# EAGLE design micromouse (EAGLE 9.5.1)
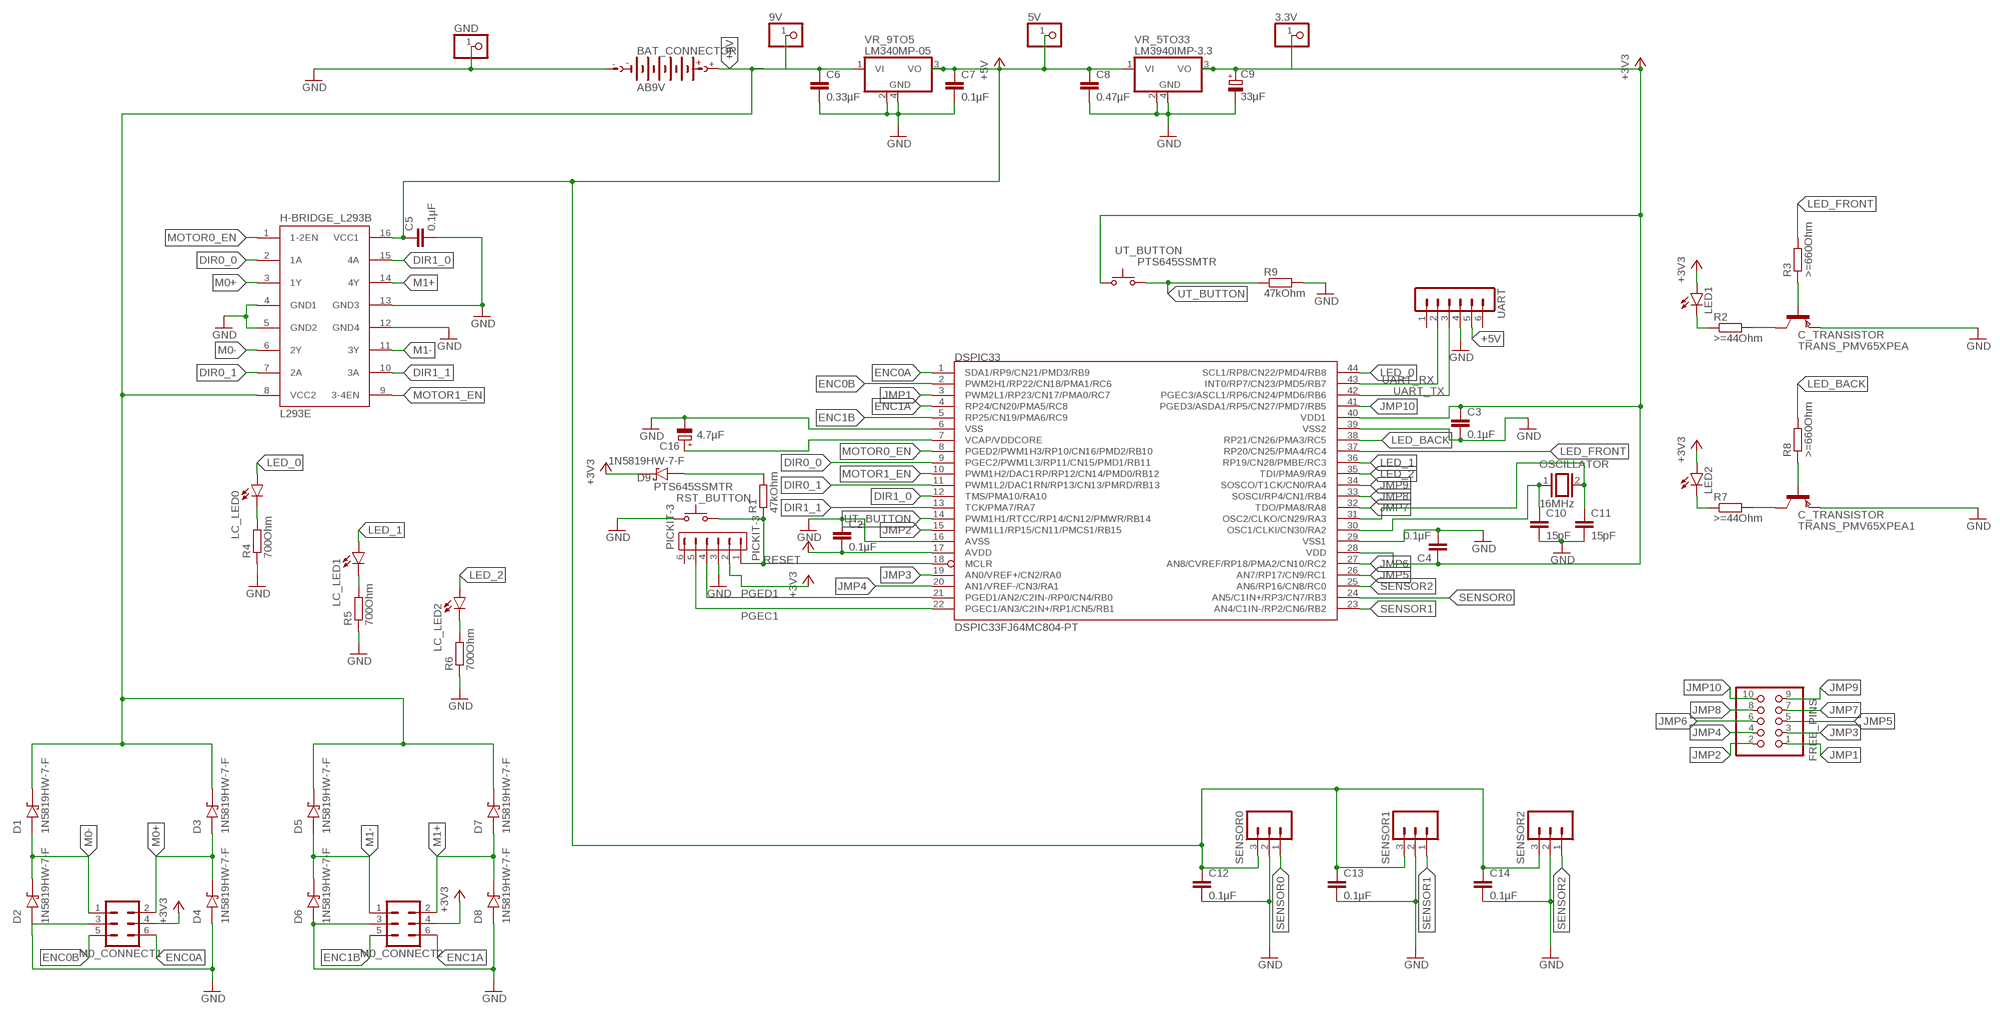
[diagram p0: schematic, sheet 1]

## Parts
3.3V  PINHD-1X1  [1X01]
5V  PINHD-1X1  [1X01]
9V  PINHD-1X1  [1X01]
BAT_CONNECTOR  AB9V  [AB9V]
C2  0.1µF  C-EUC0805  [C0805]
C3  0.1µF  C-EUC0805  [C0805]
C4  0.1µF  C-EUC0805  [C0805]
C5  0.1µF  C-EUC0805  [C0805]
C6  0.33µF  C-EUC0805  [C0805]
C7  0.1µF  C-EUC0805  [C0805]
C8  0.47µF  C-EUC0805  [C0805]
C9  33µF  CPOL-EUD/7343-31W  [D/7343-31W]
C10  15pF  C-EUC0805  [C0805]
C11  15pF  C-EUC0805  [C0805]
C12  0.1µF  C-EUC0805  [C0805]
C13  0.1µF  C-EUC0805  [C0805]
C14  0.1µF  C-EUC0805  [C0805]
C16  4.7µF  CPOL-EUCT3528  [CT3528]
D1  1N5819HW-7-F  [SOD3715X145N]
D2  1N5819HW-7-F  [SOD3715X145N]
D3  1N5819HW-7-F  [SOD3715X145N]
D4  1N5819HW-7-F  [SOD3715X145N]
D5  1N5819HW-7-F  [SOD3715X145N]
D6  1N5819HW-7-F  [SOD3715X145N]
D7  1N5819HW-7-F  [SOD3715X145N]
D8  1N5819HW-7-F  [SOD3715X145N]
D9  1N5819HW-7-F  [SOD3715X145N]
DSPIC33  DSPIC33FJ64MC804-PT  [TQFP44]
FREE_PINS  PINHD-2X5  [2X05]
GND  PINHD-1X1  [1X01]
H-BRIDGE_L293B  L293E  [DIL16]
LC_LED0  LED5MM  [LED5MM]
LC_LED1  LED5MM  [LED5MM]
LC_LED2  LED5MM  [LED5MM]
LED1  L-1503ID-LED-DLED  [L-1503ID-LED]
LED2  L-1503ID-LED-DLED  [L-1503ID-LED]
M0_CONNECT1  MA03-2  [MA03-2]
M0_CONNECT2  MA03-2  [MA03-2]
OSCILLATOR  16MHz  XTAL/S  [QS]
PICKIT-3  PICKIT-3  [1X06]
R1  47kOhm  R-EU_R0805  [R0805]
R2  >=44Ohm  R-EU_R0805  [R0805]
R3  >=660Ohm  R-EU_R0805  [R0805]
R4  700Ohm  R-EU_R0805  [R0805]
R5  700Ohm  R-EU_R0805  [R0805]
R6  700Ohm  R-EU_R0805  [R0805]
R7  >=44Ohm  R-EU_R0805  [R0805]
R8  >=660Ohm  R-EU_R0805  [R0805]
R9  47kOhm  R-EU_R0805  [R0805]
RST_BUTTON  PTS645SSMTR  [PTS645-SMD]
SENSOR0  M03  [03P]
SENSOR1  M03  [03P]
SENSOR2  M03  [03P]
TRANS_PMV65XPEA  C_TRANSISTOR  [SOT23]
TRANS_PMV65XPEA1  C_TRANSISTOR  [SOT23]
UART  MA06-1  [MA06-1]
UT_BUTTON  PTS645SSMTR  [PTS645-SMD]
VR_5TO33  LM3940IMP-3.3  [SOT223]
VR_9TO5  LM340MP-05  [SOT223]

## Nets
+3V3: 3.3V.1 C2.2 C3.1 C4.1 C9.+ D9.C(K) DSPIC33.17(AVDD) DSPIC33.28(VDD) DSPIC33.40(VDD1) LED1.A LED2.A M0_CONNECT1.4 M0_CONNECT2.4 PICKIT-3.2(VDD) UT_BUTTON.1(P) UT_BUTTON.2(P) VR_5TO33.3(VO)
+5V: 5V.1 C5.1 C7.1 C8.1 C12.1 C13.1 C14.1 H-BRIDGE_L293B.16(VCC1) SENSOR0.3 SENSOR1.3 SENSOR2.3 UART.5 VR_5TO33.1(VI) VR_9TO5.3(VO)
+9V: 9V.1 BAT_CONNECTOR.+ C6.1 D1.C(K) D3.C(K) D5.C(K) D7.C(K) H-BRIDGE_L293B.8(VCC2) VR_9TO5.1(VI)
DIR0_0: DSPIC33.9(PGEC2/PWM1L3/RP11/CN15/PMD1/RB11) H-BRIDGE_L293B.2(1A)
DIR0_1: DSPIC33.11(PWM1L2/DAC1RN/RP13/CN13/PMRD/RB13) H-BRIDGE_L293B.7(2A)
DIR1_0: DSPIC33.12(TMS/PMA10/RA10) H-BRIDGE_L293B.15(4A)
DIR1_1: DSPIC33.13(TCK/PMA7/RA7) H-BRIDGE_L293B.10(3A)
ENC0A: DSPIC33.1(SDA1/RP9/CN21/PMD3/RB9) M0_CONNECT1.6
ENC0B: DSPIC33.2(PWM2H1/RP22/CN18/PMA1/RC6) M0_CONNECT1.5
ENC1A: DSPIC33.4(RP24/CN20/PMA5/RC8) M0_CONNECT2.6
ENC1B: DSPIC33.5(RP25/CN19/PMA6/RC9) M0_CONNECT2.5
GND: BAT_CONNECTOR.- C2.1 C3.2 C4.2 C5.2 C6.2 C7.2 C8.2 C9.- C10.2 C11.2 C12.2 C13.2 C14.2 C16.- D2.A D4.A D6.A D8.A DSPIC33.6(VSS) DSPIC33.16(AVSS) DSPIC33.29(VSS1) DSPIC33.39(VSS2) GND.1 H-BRIDGE_L293B.4(GND1) H-BRIDGE_L293B.5(GND2) H-BRIDGE_L293B.12(GND4) H-BRIDGE_L293B.13(GND3) M0_CONNECT1.3 M0_CONNECT2.3 PICKIT-3.3(VSS) R4.1 R5.1 R6.1 R9.2 RST_BUTTON.1(P) RST_BUTTON.2(P) SENSOR0.2 SENSOR1.2 SENSOR2.2 TRANS_PMV65XPEA1.2(E) TRANS_PMV65XPEA.2(E) UART.4 VR_5TO33.2(GND1) VR_5TO33.4(GND) VR_9TO5.2(GND1) VR_9TO5.4(GND)
JMP1: DSPIC33.3(PWM2L1/RP23/CN17/PMA0/RC7) FREE_PINS.1
JMP2: DSPIC33.15(PWM1L1/RP15/CN11/PMCS1/RB15) FREE_PINS.2
JMP3: DSPIC33.19(AN0/VREF+/CN2/RA0) FREE_PINS.3
JMP4: DSPIC33.20(AN1/VREF-/CN3/RA1) FREE_PINS.4
JMP5: DSPIC33.26(AN7/RP17/CN9/RC1) FREE_PINS.5
JMP6: DSPIC33.27(AN8/CVREF/RP18/PMA2/CN10/RC2) FREE_PINS.6
JMP7: DSPIC33.32(TDO/PMA8/RA8) FREE_PINS.7
JMP8: DSPIC33.33(SOSCI/RP4/CN1/RB4) FREE_PINS.8
JMP9: DSPIC33.34(SOSCO/T1CK/CN0/RA4) FREE_PINS.9
JMP10: DSPIC33.41(PGED3/ASDA1/RP5/CN27/PMD7/RB5) FREE_PINS.10
LED_0: DSPIC33.44(SCL1/RP8/CN22/PMD4/RB8) LC_LED0.A
LED_1: DSPIC33.36(RP19/CN28/PMBE/RC3) LC_LED1.A
LED_2: DSPIC33.35(TDI/PMA9/RA9) LC_LED2.A
LED_BACK: DSPIC33.38(RP21/CN26/PMA3/RC5) R8.2
LED_FRONT: DSPIC33.37(RP20/CN25/PMA4/RC4) R3.2
M0+: D3.A D4.C(K) H-BRIDGE_L293B.3(1Y) M0_CONNECT1.2
M0-: D1.A D2.C(K) H-BRIDGE_L293B.6(2Y) M0_CONNECT1.1
M1+: D7.A D8.C(K) H-BRIDGE_L293B.14(4Y) M0_CONNECT2.2
M1-: D5.A D6.C(K) H-BRIDGE_L293B.11(3Y) M0_CONNECT2.1
MOTOR0_EN: DSPIC33.8(PGED2/PWM1H3/RP10/CN16/PMD2/RB10) H-BRIDGE_L293B.1(1-2EN)
MOTOR1_EN: DSPIC33.10(PWM1H2/DAC1RP/RP12/CN14/PMD0/RB12) H-BRIDGE_L293B.9(3-4EN)
N$2: LED1.K(C) R2.1
N$3: D9.A R1.2
N$6: LC_LED1.K(C) R5.2
N$10: LC_LED2.K(C) R6.2
N$11: LC_LED0.K(C) R4.2
N$12: R2.2 TRANS_PMV65XPEA.3(C)
N$13: R3.1 TRANS_PMV65XPEA.1(B)
N$14: LED2.K(C) R7.1
N$15: R7.2 TRANS_PMV65XPEA1.3(C)
N$16: R8.1 TRANS_PMV65XPEA1.1(B)
OSC1: C10.1 DSPIC33.30(OSC1/CLKI/CN30/RA2) OSCILLATOR.1
OSC2: C11.1 DSPIC33.31(OSC2/CLKO/CN29/RA3) OSCILLATOR.2
PGEC1: DSPIC33.22(PGEC1/AN3/C2IN+/RP1/CN5/RB1) PICKIT-3.5(PGC)
PGED1: DSPIC33.21(PGED1/AN2/C2IN-/RP0/CN4/RB0) PICKIT-3.4(PGD)
RESET: DSPIC33.18(MCLR) PICKIT-3.1(MCLR) R1.1 RST_BUTTON.3(S) RST_BUTTON.4(S)
SENSOR0: DSPIC33.24(AN5/C1IN+/RP3/CN7/RB3) SENSOR0.1
SENSOR1: DSPIC33.23(AN4/C1IN-/RP2/CN6/RB2) SENSOR1.1
SENSOR2: DSPIC33.25(AN6/RP16/CN8/RC0) SENSOR2.1
UART_RX: DSPIC33.43(INT0/RP7/CN23/PMD5/RB7) UART.2
UART_TX: DSPIC33.42(PGEC3/ASCL1/RP6/CN24/PMD6/RB6) UART.3
UT_BUTTON: DSPIC33.14(PWM1H1/RTCC/RP14/CN12/PMWR/RB14) R9.1 UT_BUTTON.3(S) UT_BUTTON.4(S)
VCAP/VDDCORE: C16.+ DSPIC33.7(VCAP/VDDCORE)
Unconnected: PICKIT-3.6(LVP) UART.1 UART.6

## Library data of the parts
3.3V 5V 9V GND = pinhead:PINHD-1X1: PIN HEADER
BAT_CONNECTOR = battery:AB9V: 9-V BATTERY CLIP
C2-C8 C10-C14 = rcl:C-EU: CAPACITOR, European symbol; SPICEPREFIX: C
C9 C16 = rcl:CPOL-EU: POLARIZED CAPACITOR, European symbol; SPICEPREFIX: C
D1-D9 = 1N5819HW-7-F:1N5819HW-7-F: 1N5819HW Series 40 V 1 A Surface Mount Schottky Barrier Rectifier - SOD-123; AVAILABILITY: Unavailable; DESCRIPTION: 1N5819HW Series 40 V 1 A Surface Mount Schottky Barrier Rectifier - SOD-123; MF: Diodes Inc.; MP: 1N5819HW-7-F; PACKAGE: SOD-123 Diodes Inc.; PRICE: None
DSPIC33 = microchip-dspic33fjxxmc:DSPIC33FJ64MC804: dsPIC33FJ32MC302/304, dsPIC33FJ64MCX02/X04, AND dsPIC33FJ128MCX02/X04 High-Performance, 16-bit Digital Signal Controllers Package:44 Pin TQFP Operating Range: * Up to 40 MIPS operation (at 3.0V -3.6V): - Industrial temperature range (-40°C to +85°C) - Extended temperature range (-40°C to +125°C) High-Performance DSC CPU: * Modified Harvard architecture * C compiler optimized instruction set * 16-bit wide data path * 24-bit wide instructions * Linear program memory addressing up to 4M instruction words * Linear data memory addressing up to 64 Kbytes * 83 base instructions: mostly 1 word/1 cycle * Two 40-bit accumulators with rounding and saturation options * Flexible and powerful addressing modes: - Indirect - Modulo - Bit-Reversed * Software stack * 16 x 16 fractional/integer multiply operations * 32/16 and 16/16 divide operations * Single-cycle multiply and accumulate: - Accumulator write back for DSP operations - Dual data fetch * Up to ±16-bit shifts for up to 40-bit data Direct Memory Access (DMA): * 8-channel hardware DMA * Up to 2 Kbytes dual ported DMA buffer area (DMA RAM) to store data transferred via DMA: - Allows data transfer between RAM and a peripheral while CPU is executing code (no cycle stealing) * Most peripherals support DMA Timers/Capture/Compare/PWM: * Timer/Counters, up to five 16-bit timers: - Can pair up to make two 32-bit timers - One timer runs as a Real-Time Clock with an external 32.768 kHz oscillator - Programmable prescaler * Input Capture (up to four channels): - Capture on up, down or both edges - 16-bit capture input functions - 4-deep FIFO on each capture * Output Compare (up to four channels): - Single or Dual 16-bit Compare mode - 16-bit Glitchless PWM mode * Hardware Real-Time Clock/Calendar (RTCC): - Provides clock, calendar, and alarm functions Interrupt Controller: * 5-cycle latency * Up to 53 available interrupt sources * Up to three external interrupts * Seven programmable priority levels * Five processor exceptions Digital I/O: * Peripheral pin Select functionality * Up to 35 programmable digital I/O pins * Wake-up/Interrupt-on-Change for up to 31 pins * Output pins can drive from 3.0V to 3.6V * Up to 5V output with open drain configuration * All digital input pins are 5V tolerant * 4 mA sink on all I/O pins On-Chip Flash and SRAM: * Flash program memory (up to 128 Kbytes) * Data SRAM (up to 16 Kbytes) * Boot, Secure, and General Security for program Flash System Management: * Flexible clock options: - External, crystal, resonator, internal RC - Fully integrated Phase-Locked Loop (PLL) - Extremely low jitter PLL * Power-up Timer * Oscillator Start-up Timer/Stabilizer * Watchdog Timer with its own RC oscillator * Fail-Safe Clock Monitor * Reset by multiple sources Power Management: * On-chip 2.5V voltage regulator * Switch between clock sources in real time * Idle, Sleep, and Doze modes with fast wake-up Analog-to-Digital Converters (ADCs): * 10-bit, 1.1 Msps or 12-bit, 500 Ksps conversion: - Two and four simultaneous samples (10-bit ADC) - Up to nine input channels with auto-scanning - Conversion start can be manual or synchronized with one of four trigger sources - Conversion possible in Sleep mode - ±2 LSb max integral nonlinearity - ±1 LSb max differential nonlinearity Audio Digital-to-Analog Converter (DAC): - 16-bit Dual Channel DAC module - 100 Ksps maximum sampling rate - Second-Order Digital Delta-Sigma Modulator Comparator Module: * Two analog comparators with programmable input/output configuration CMOS Flash Technology: * Low-power, high-speed Flash technology * Fully static design * 3.3V (±10%) operating voltage * Industrial and Extended temperature * Low power consumption Motor Control Peripherals: * 6-channel 16-bit Motor Control PWM: - Three duty cycle generators - Independent or Complementary mode - Programmable dead-time and output polarity - Edge-aligned or center-aligned - Manual output override control - One Fault input - Trigger for ADC conversions - PWM frequency for 16-bit resolution (@ 40 MIPS) = 1220 Hz for Edge-Aligned mode, 610 Hz for Center-Aligned mode - PWM frequency for 11-bit resolution (@ 40 MIPS) = 39.1 kHz for Edge-Aligned mode, 19.55 kHz for Center-Aligned mode * 2-channel 16-bit Motor Control PWM: - One duty cycle generator - Independent or Complementary mode - Programmable dead time and output polarity - Edge-aligned or center-aligned - Manual output override control - One Fault input - Trigger for ADC conversions - PWM frequency for 16-bit resolution (@ 40 MIPS) = 1220 Hz for Edge-Aligned mode, 610 Hz for Center-Aligned mode - PWM frequency for 11-bit resolution (@ 40 MIPS) = 39.1 kHz for Edge-Aligned mode, 19.55 kHz for Center-Aligned mode * 2-Quadrature Encoder Interface module: - Phase A, Phase B, and index pulse input - 16-bit up/down position counter - Count direction status - Position Measurement (x2 and x4) mode - Programmable digital noise filters on inputs - Alternate 16-bit Timer/Counter mode - Interrupt on position counter rollover/underflow
FREE_PINS = pinhead:PINHD-2X5: PIN HEADER
H-BRIDGE_L293B = texas:L293E: TI DEVICE; MF: Arrow Electronics; MPN: L293E; OC_FARNELL: 1467711; OC_NEWARK: 89K0732
LC_LED0 LC_LED1 LC_LED2 = led:LED: LED OSRAM: - CHIPLED LG R971, LG N971, LY N971, LG Q971, LY Q971, LO R971, LY R971 LH N974, LH R974 LS Q976, LO Q976, LY Q976 LO Q996 - Hyper CHIPLED LW Q18S LB Q993, LB Q99A, LB R99A - SideLED LS A670, LO A670, LY A670, LG A670, LP A670 LB A673, LV A673, LT A673, LW A673 LH A674 LY A675 LS A676, LA A676, LO A676, LY A676, LW A676 LS A679, LY A679, LG A679 - Hyper Micro SIDELED® LS Y876, LA Y876, LO Y876, LY Y876 LT Y87S - SmartLED LW L88C, LW L88S LB L89C, LB L89S, LG L890 LS L89K, LO L89K, LY L89K LS L896, LA L896, LO L896, LY L896 - TOPLED LS T670, LO T670, LY T670, LG T670, LP T670 LSG T670, LSP T670, LSY T670, LOP T670, LYG T670 LG T671, LOG T671, LSG T671 LB T673, LV T673, LT T673, LW T673 LH T674 LS T676, LA T676, LO T676, LY T676, LB T676, LH T676, LSB T676, LW T676 LB T67C, LV T67C, LT T67C, LS T67K, LO T67K, LY T67K, LW E67C LS E67B, LA E67B, LO E67B, LY E67B, LB E67C, LV E67C, LT E67C LW T67C LS T679, LY T679, LG T679 LS T770, LO T770, LY T770, LG T770, LP T770 LB T773, LV T773, LT T773, LW T773 LH T774 LS E675, LA E675, LY E675, LS T675 LS T776, LA T776, LO T776, LY T776, LB T776 LHGB T686 LT T68C, LB T68C - Hyper Mini TOPLED® LB M676 - Mini TOPLED Santana® LG M470 LS M47K, LO M47K, LY M47K Source: http://www.osram.convergy.de LUXEON: - LUMILED® LXK2-PW12-R00, LXK2-PW12-S00, LXK2-PW14-U00, LXK2-PW14-V00 LXK2-PM12-R00, LXK2-PM12-S00, LXK2-PM14-U00 LXK2-PE12-Q00, LXK2-PE12-R00, LXK2-PE12-S00, LXK2-PE14-T00, LXK2-PE14-U00 LXK2-PB12-K00, LXK2-PB12-L00, LXK2-PB12-M00, LXK2-PB14-N00, LXK2-PB14-P00, LXK2-PB14-Q00 LXK2-PR12-L00, LXK2-PR12-M00, LXK2-PR14-Q00, LXK2-PR14-R00 LXK2-PD12-Q00, LXK2-PD12-R00, LXK2-PD12-S00 LXK2-PH12-R00, LXK2-PH12-S00 LXK2-PL12-P00, LXK2-PL12-Q00, LXK2-PL12-R00 Source: www.luxeon.com KINGBRIGHT: KA-3528ASYC Source: www.kingbright.com
LED1 LED2 = MM_lib:L-1503ID-LED-D: Throughhole 5mm LED for our MM project
M0_CONNECT1 M0_CONNECT2 = con-lstb_cedric:MA03-2: PIN HEADER; OC_FARNELL: unknown; OC_NEWARK: unknown
OSCILLATOR = special:XTAL/S: CRYSTAL
PICKIT-3 = MM_lib:PICKIT-3
R1-R9 = rcl:R-EU_: RESISTOR, European symbol; SPICEPREFIX: R
RST_BUTTON UT_BUTTON = switch-ck:PTS645S???SMTR: TACT SWITCH
SENSOR0 SENSOR1 SENSOR2 = con-amp-quick:M03: AMP QUICK CONNECTOR; OC_FARNELL: unknown; OC_NEWARK: unknown
TRANS_PMV65XPEA TRANS_PMV65XPEA1 = MM_lib:C_TRANSISTOR
UART = con-lstb:MA06-1: PIN HEADER; OC_FARNELL: unknown; OC_NEWARK: unknown
VR_5TO33 = MM_lib:LM3940?-*: Positive VOLTAGE REGULATOR Source: http://cache.national.com/ds/LM/LM340.pdf
VR_9TO5 = MM_lib:LM340?-*: Positive VOLTAGE REGULATOR Source: http://cache.national.com/ds/LM/LM340.pdf

## Module TEST
Ports: 

### Library data of the parts

## Board
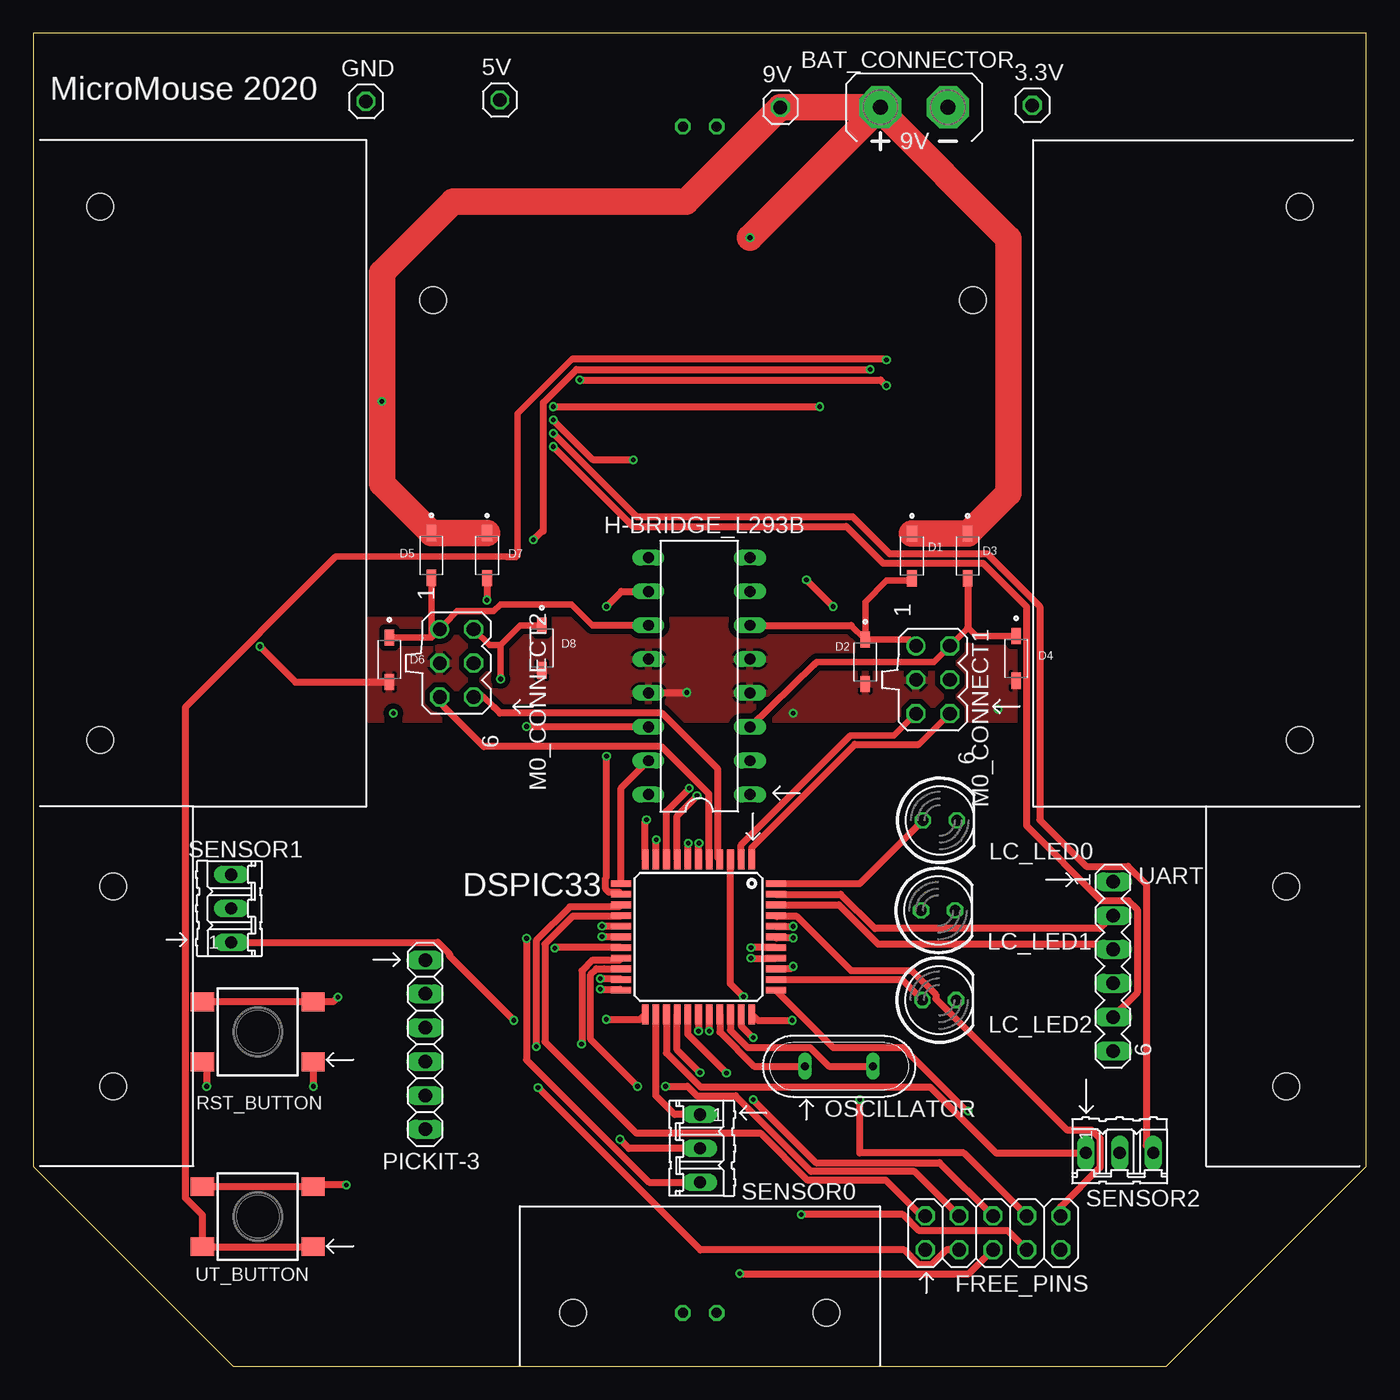
[diagram p1: board, top side]
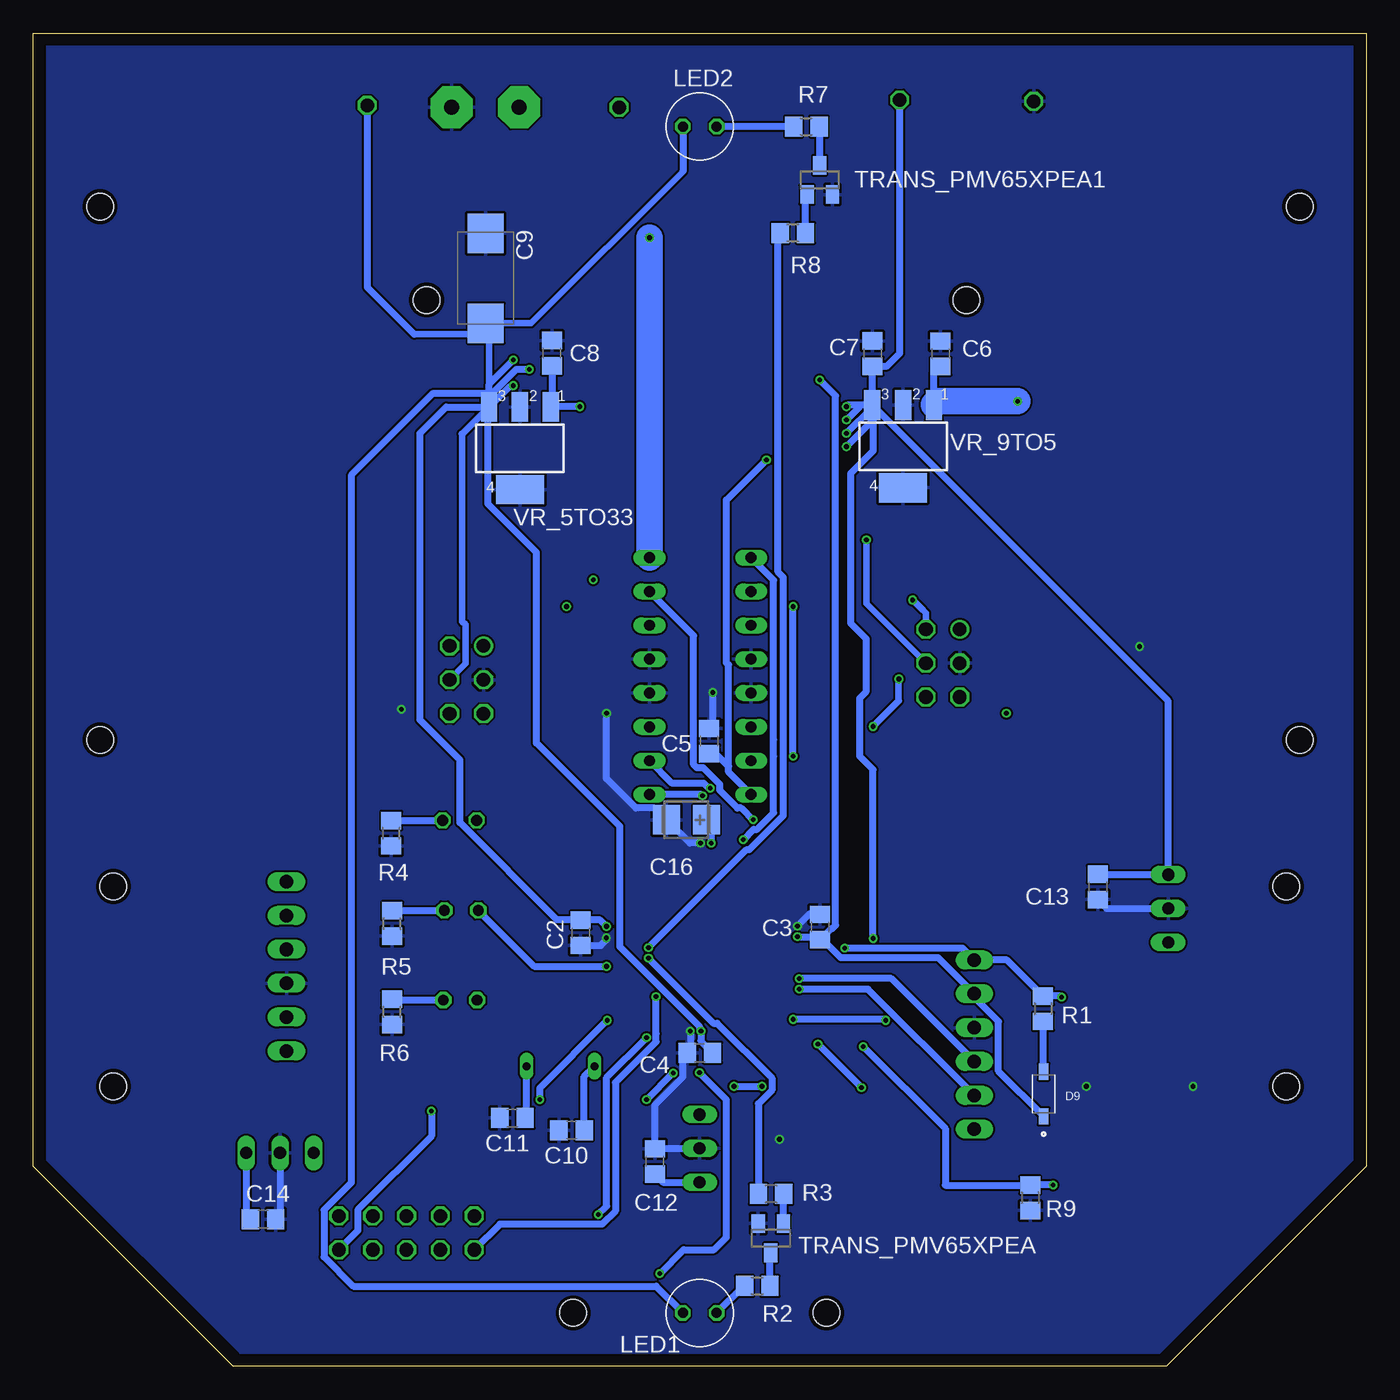
[diagram p2: board, bottom side, seen from below]

Size 100 x 100 mm. Coordinates in mm from the lower left corner, seen from the top.
Outline: 15,0 85,0 100,15 100,100 0,100 0,15 15,0
Copper layers (1*16): Top 0.035mm / dielectric 1.5mm / Bottom 0.035mm
Design rules "PCB-POOL Standard": minimum track width 0.15mm, minimum drill 0.3mm, track to track 0.15mm, track to pad 0.15mm, pad to pad 0.15mm, via to via 0.15mm, smd to smd 0.15mm, copper to edge 0.3mm, drill to drill 0.2mm, minimum pad ring 0.2mm, minimum via ring 0.15mm, stop-mask expansion 0.03mm, vias tented up to drill 0mil, thermal gap 0.2mm
Holes 2 mm at 5,87 5,47 95,47 95,87 6,36 6,21 94,36 94,21 59.5,4 40.5,4 30,80 70.5,80

### Footprints (pad centres in the part's own frame; a part is rotated, then mirrored left to right if it is on the bottom)
1X01 = drill 1.016 octagon: 1 0,0
AB9V = drill 1.118 pad 3.15 octagon: + 0,2.54; - 0,-2.54
C0805 = smd 1.3 x 1.5: 1 -0.95,0; 2 0.95,0
D/7343-31W = smd 2.95 x 2.7: + 3.375,0; - -3.375,0
CT3528 = smd 2 x 2.2: + -1.5,0; - 1.5,0
SOD3715X145N = smd 1.21 x 0.73: A 1.68,0; C -1.68,0
TQFP44 = smd 1.5 x 0.5: 1 -5.8,4; 2 -5.8,3.2; 3 -5.8,2.4; 4 -5.8,1.6; 5 -5.8,0.8; 6 -5.8,0; 7 -5.8,-0.8; 8 -5.8,-1.6; 9 -5.8,-2.4; 10 -5.8,-3.2; 11 -5.8,-4; 23 5.8,-4; 24 5.8,-3.2; 25 5.8,-2.4; 26 5.8,-1.6; 27 5.8,-0.8; 28 5.8,0; 29 5.8,0.8; 30 5.8,1.6; 31 5.8,2.4; 32 5.8,3.2; 33 5.8,4 | smd 0.5 x 1.5: 12 -4,-5.8; 13 -3.2,-5.8; 14 -2.4,-5.8; 15 -1.6,-5.8; 16 -0.8,-5.8; 17 0,-5.8; 18 0.8,-5.8; 19 1.6,-5.8; 20 2.4,-5.8; 21 3.2,-5.8; 22 4,-5.8; 34 4,5.8; 35 3.2,5.8; 36 2.4,5.8; 37 1.6,5.8; 38 0.8,5.8; 39 0,5.8; 40 -0.8,5.8; 41 -1.6,5.8; 42 -2.4,5.8; 43 -3.2,5.8; 44 -4,5.8
2X05 = drill 1.016 octagon: 1 -5.08,-1.27; 2 -5.08,1.27; 3 -2.54,-1.27; 4 -2.54,1.27; 5 0,-1.27; 6 0,1.27; 7 2.54,-1.27; 8 2.54,1.27; 9 5.08,-1.27; 10 5.08,1.27
DIL16 = drill 0.813 long: 1 -8.89,-3.81; 2 -6.35,-3.81; 3 -3.81,-3.81; 4 -1.27,-3.81; 5 1.27,-3.81; 6 3.81,-3.81; 7 6.35,-3.81; 8 8.89,-3.81; 9 8.89,3.81; 10 6.35,3.81; 11 3.81,3.81; 12 1.27,3.81; 13 -1.27,3.81; 14 -3.81,3.81; 15 -6.35,3.81; 16 -8.89,3.81
LED5MM = drill 0.813 octagon: A -1.27,0; K 1.27,0
L-1503ID-LED = drill 0.75 octagon: A -1.27,0; K 1.27,0
MA03-2 = drill 1.016: 1 -2.54,-1.27 | drill 1.016 octagon: 2 -2.54,1.27; 3 0,-1.27; 4 0,1.27; 5 2.54,-1.27; 6 2.54,1.27
QS = drill 0.61 long: 1 -2.54,0; 2 2.54,0
1X06 = drill 1.016 long: 1 -6.35,0; 2 -3.81,0; 3 -1.27,0; 4 1.27,0; 5 3.81,0; 6 6.35,0
R0805 = smd 1.3 x 1.5: 1 -0.95,0; 2 0.95,0
PTS645-SMD = smd 1.75 x 1.4: 1 -4.15,2.25; 2 4.15,2.25; 3 -4.15,-2.25; 4 4.15,-2.25
03P = drill 0.914 long: 1 -2.54,0; 2 0,0; 3 2.54,0
SOT23 = smd 1 x 1.4: 1 -0.95,-1.1; 2 0.95,-1.1; 3 0,1.1
MA06-1 = drill 1.016 long: 1 -6.35,0; 2 -3.81,0; 3 -1.27,0; 4 1.27,0; 5 3.81,0; 6 6.35,0
SOT223 = smd 1.219 x 2.235: 1 -2.311,-3.099; 2 0,-3.099; 3 2.311,-3.099 | smd 3.6 x 2.2: 4 0,3.099

### Placement (x,y rotation side)
3.3V  74.95,94.6 0 top
5V  35,95 0 top
9V  56.05,94.45 0 top
BAT_CONNECTOR  66.09,94.45 90 top
C2  58.93,32.52 90 bottom
C3  40.97,32.95 90 bottom
C4  50,23.51 180 bottom
C5  49.3,46.9 90 bottom
C6  31.93,75.96 90 bottom
C7  37.03,75.97 90 bottom
C8  61.09,76.01 90 bottom
C9  66.06,81.62 270 bottom
C10  59.62,17.71 180 bottom
C11  64.06,18.63 180 bottom
C12  53.37,15.36 90 bottom
C13  20.13,35.96 270 bottom
C14  82.77,11.03 0 bottom
C16  51,41 180 bottom
D1  65.92,60.79 270 top
D2  62.42,52.85 270 top
D3  70.1,60.79 270 top
D4  73.74,53.11 270 top
D5  29.87,60.83 270 top
D6  26.7,53 270 top
D7  34.04,60.82 270 top
D8  38.15,53.89 270 top
D9  24.2,20.42 90 bottom
DSPIC33  49.9,32.21 270 top
FREE_PINS  72,10 0 top
GND  24.95,94.9 0 top
H-BRIDGE_L293B  49.96,51.78 90 top
LC_LED0  68.02,40.95 0 top
LC_LED1  67.89,34.19 0 top
LC_LED2  67.97,27.47 0 top
LED1  50,4 0 bottom
LED2  50,93 0 bottom
M0_CONNECT1  67.5,51.5 270 top
M0_CONNECT2  31.76,52.75 270 top
OSCILLATOR  60.44,22.5 0 top
PICKIT-3  29.4,24.13 270 top
R1  24.24,26.82 270 bottom
R2  45.68,6.03 0 bottom
R3  44.65,12.92 180 bottom
R4  73.14,39.98 90 bottom
R5  73.07,33.22 90 bottom
R6  73.1,26.58 90 bottom
R7  42,93 0 bottom
R8  43.02,85.02 180 bottom
R9  25.21,12.63 270 bottom
RST_BUTTON  PTS645S??SMTR  [PTS645-SMD]  16.85,25.08 180 top
SENSOR0  50.01,16.34 270 top
SENSOR1  14.85,34.34 90 top
SENSOR2  81.5,16 0 top
TRANS_PMV65XPEA  44.67,9.6 180 bottom
TRANS_PMV65XPEA1  41,89 0 bottom
UART  81,30 270 top
UT_BUTTON  PTS645S??SMTR  [PTS645-SMD]  16.84,11.22 180 top
VR_5TO33  63.49,68.87 180 bottom
VR_9TO5  34.75,69 180 bottom

### Tracks (layer width: path | path; a pad name or v marks a point on that pad's centre or on a via)
+3V3  (via drill 0.35)
  Top 0.5: 22.7,60.73 35.54,60.73 35.56,60.71 36.21,60.71 36.32,60.82 36.32,71.45 40.42,75.55
  Top 0.508: DSPIC33.40 v56.99,33.01 v57,33 | DSPIC33.17 42.68,32.21 v42.67,32.22 | DSPIC33.28 v49.9,25.16 v49.91,25.15 | v62.78,74.78 40.75,74.78 38.27,72.3 38.27,62.66 38.16,62.66 v37.5,62 | v41,74 63.56,74 v64,73.56 | UT_BUTTON.1 UT_BUTTON.2 12.69,11.32 11.41,12.6 11.41,49.45 22.7,60.73 | 40.42,75.55 63.95,75.55 v64,75.5
  Bottom 0.5: 67.84,69.93 67.84,64.29 67.82,64.26 67.82,55.88 67.56,55.63 67.56,52.71 M0_CONNECT1.4 | v37.5,62 37.5,57.21 M0_CONNECT2.4 | 51.27,89.63 62.66,78.25 C9.+ 66.06,77.7 | 71.42,77.42 66.34,77.42 66.06,77.7 | VR_5TO33.3 65.8,77.44 66.06,77.7
  Bottom 0.508: v57,33 57.47,33.47 C2.2 58.97,33.5 60.72,33.5 68,40.78 68,45.5 71,48.5 71,70 69.03,71.97 VR_5TO33.3 | v42.67,32.22 41.19,32.22 C3.1 | VR_5TO33.3 65.89,71.89 | 65.89,71.89 67.84,69.93 | C3.1 40.77,32 39.42,30.64 32.1,30.64 29.73,28.27 | PICKIT-3.2 29.73,28.27 | D9.C 27.58,22.12 27.58,25.86 29.73,28.01 29.73,28.27 | 65.89,71.89 65.89,64.7 62.25,61.06 62.25,46.75 56,40.5 56,31.47 49.98,25.45 49.98,25.22 v49.91,25.15 49.91,24.44 49.9,24.43 49.9,24.35 C4.1 | v64,73.56 64.07,73.49 64.27,73.49 65.88,71.89 65.89,71.89 | LED2.A 51.27,89.63 | C3.1 40.12,32.84 40.05,32.84 39.81,33.08 39.81,72.81 v41,74 | VR_5TO33.3 65.8,72.75 63.77,74.78 v62.78,74.78 | VR_5TO33.3 65.8,73 | 65.8,73 65.8,73.7 v64,75.5 | 65.8,73 70,73 76.15,66.85 76.15,13.77 78.19,11.73 78.19,8.19 76,6 53.27,6 LED1.A | 71.42,77.42 74.95,80.95 3.3V.1
+5V  (via drill 0.35)
  Top 0.508: v39,72 v59,72 | v39,70 45.27,63.73 61.46,63.73 64.23,60.95 71.55,60.95 75.5,57 75.5,41 79,37.5 82.13,37.5 83.5,36.13 83.5,16.54 SENSOR2.3 | v45,68 42,68 v39,71 | SENSOR0.3 46.2,13.8 37,23 v37,32.1 | v39,69 45,63 49.02,63 61,63 63.75,60.25 71.25,60.25 74.51,56.99 74.51,40.56 80.15,34.92 82.17,34.92 82.82,34.27 82.82,28.01 UART.5
  Bottom 0.508: C8.1 61.09,72.07 VR_5TO33.1 61.15,72 v59,72 | VR_9TO5.3 37.03,72.13 37.03,75 | 37.03,75 C7.1 | VR_9TO5.3 38,72.1 | 38,72.1 38.9,72.1 v39,72 | H-BRIDGE_L293B.16 47.84,44.58 47.84,45 | 47.84,45 47.84,52.62 48,52.78 48,65 v45,68 | 47.84,45 48.79,45.95 C5.1 | C13.1 14.88,36.91 SENSOR1.3 14.85,49.89 36.98,72.02 | 36.98,72.02 VR_9TO5.3 | 36.98,72 36.98,68.68 38.66,67 38.66,55.73 37.5,54.57 37.5,50.62 38,50.12 38,45.75 37,44.75 v37,32.1 | 36.98,72 36.98,72.02 | v39,70 38.98,70 36.98,72 | SENSOR2.3 84.04,11.35 C14.1 | v39,71 38,72 38,72.1 | C12.1 52.76,13.8 SENSOR0.3 | 37.03,75 36,75 35,76 5V.1 | VR_9TO5.3 37.06,70.94 v39,69
+9V  (via drill 0.35)
  Top 2: BAT_CONNECTOR.+ v53.77,84.67 | BAT_CONNECTOR.+ 9V.1 48.98,87.38 31.5,87.38 26.16,82.04 v26.16,72.39 26.16,66.21 D5.C D7.C | BAT_CONNECTOR.+ 63.55,94.21 73.15,84.61 73.15,65.52 D3.C D1.C
  Bottom 0.508: VR_9TO5.1 32.44,72.14 32.44,74.5 C6.1
  Bottom 2: H-BRIDGE_L293B.8 v53.77,84.67 | v26.16,72.39 32.18,72.39 32.44,72.14
DIR0_0  (via drill 0.35)
  Top 0.508: DSPIC33.9 47.5,41.63 v49.22,43.36
  Bottom 0.508: v49.22,43.36 49.33,43.36 49.7,43.73 52.07,43.73 H-BRIDGE_L293B.2
DIR0_1  (via drill 0.35)
  Top 0.508: DSPIC33.11 45.9,40.9 v46,41
  Bottom 0.508: v46,41 46.88,41.88 47.17,41.88 48.49,43.2 48.49,43.66 49.73,44.9 50.22,44.9 50.45,45.13 50.45,54.81 H-BRIDGE_L293B.7
DIR1_0
  Top 0.508: DSPIC33.12 44.1,43.38 H-BRIDGE_L293B.15
DIR1_1  (via drill 0.35)
  Top 0.508: DSPIC33.13 43.96,35.55 43.19,35.55 42.95,35.79 42.95,36.63 43,36.68 v43,45.75 | v43,57 44.13,58.13 H-BRIDGE_L293B.10
  Bottom 0.508: v43,45.75 v43,57
ENC0A
  Top 0.5: 66.41,46.65 66.46,46.65 M0_CONNECT1.6
  Top 0.508: DSPIC33.1 53.9,38.91 61.64,46.65 66.41,46.65
ENC0B
  Top 0.5: M0_CONNECT1.5 64.58,47.31 61.31,47.31
  Top 0.508: DSPIC33.2 53.1,39.1 61.31,47.31
ENC1A
  Top 0.5: 34.56,49.44 33.79,50.21 M0_CONNECT2.6
  Top 0.508: DSPIC33.4 51.36,38.15 51.36,44.79 47.15,49 35,49 34.56,49.44
ENC1B
  Top 0.5: 30.82,49.44 30.49,49.77 M0_CONNECT2.5
  Top 0.508: DSPIC33.5 50.68,38.03 50.68,42.93 47.13,46.48 33.78,46.48 30.82,49.44
GND  (via drill 0.35)
  Top 0.5: D4.A 73.63,51.31
  Top 0.508: v57.02,32.13 55.78,32.13 DSPIC33.39 | DSPIC33.16 42.68,33.01 v42.67,33.02 | DSPIC33.6 49.9,39.19 v49.95,39.24 | v49.02,50.55 48.98,50.51 H-BRIDGE_L293B.13 | RST_BUTTON.1 v21,21 | RST_BUTTON.2 13,22.53 v13,21 | DSPIC33.29 v50.7,25.16 v50.71,25.15 | SENSOR0.2 44.69,16.34 v44.02,17.02 | D6.A 19.68,51.32 v17,54
  Bottom 0.508: C3.2 41.07,34 41.69,34 v42.67,33.02 | C2.1 57.43,31.57 57.02,31.98 v57.02,32.13 | C5.2 49.02,48.12 v49.02,50.55 | C13.2 19.46,34.34 SENSOR1.2 | SENSOR2.2 81.5,11.35 C14.2 | v50.71,25.15 50.71,23.75 C4.2 51.27,23.19 51.27,21.7 53.37,19.6 C12.2 53.34,16.34 SENSOR0.2 | v49.95,39.24 50.74,39.24 C16.- 53.38,41.88 54.79,41.88 57,44.08 v57,49
  other vias: 72.39,49.28
  pour Top (isolate 0.4): 25.25,56 75,56 75,48.51 25.25,48.51
  pour Bottom: 15.5,1 1,15.5 1,99 99,99 99,15.5 84.5,1
JMP1  (via drill 0.35)
  Top 0.508: v53.28,27.72 52.3,28.7 DSPIC33.3
  Bottom 0.508: v53.28,27.72 53.28,24.96 53.27,24.95 53.27,24.34 54.81,22.81 55,22.61 56.33,21.28 56.33,11.64 57.32,10.65 65,10.65 FREE_PINS.1
JMP2
  Top 0.508: FREE_PINS.2 66.64,11.27 63.95,13.96 58.08,13.96 54.54,17.5 45.23,17.5 38.39,24.34 38.39,31.67 40.47,33.75 44.04,33.75 DSPIC33.15
JMP3  (via drill 0.35)
  Top 0.508: DSPIC33.19 43.96,30.47 41.97,30.47 41.16,29.66 41.16,24.19 v41.13,24.16 | FREE_PINS.3 68.49,8.73 67.38,7.62 66.46,7.62 65.35,8.73 50.05,8.73 v37.87,20.91
  Bottom 0.508: v41.13,24.16 v37.87,20.91
JMP4  (via drill 0.35)
  Top 0.508: FREE_PINS.4 66.12,14.61 58.36,14.61 52.69,20.28 49.79,20.28 49.07,21 v47.43,21 | v45.33,21 41.82,24.51 41.82,29.39 42.24,29.81 42.85,29.81 DSPIC33.20
  Bottom 0.508: v47.43,21 v45.33,21
JMP5  (via drill 0.35)
  Top 0.508: DSPIC33.26 48.3,23.73 v50.02,22.02 | v53,6.94 70.21,6.94 FREE_PINS.5
  Bottom 0.508: v53,6.94 51.2,8.74 48.91,8.74 48,9.65 48,20 v50.02,22.02
JMP6  (via drill 0.35)
  Top 0.508: FREE_PINS.6 68,15.27 58.73,15.27 v54,20 | v52,22 49.1,24.9 DSPIC33.27
  Bottom 0.508: v54,20 v52,22
JMP7  (via drill 0.35)
  Top 0.508: DSPIC33.32 53.1,25.54 v54,24.64 | FREE_PINS.7 73.11,10.16 66.46,10.16 65.24,11.38 v57.62,11.38
  Bottom 0.508: v54,24.64 56.99,21.65 56.99,12.01 v57.62,11.38
JMP8  (via drill 0.35)
  Top 0.508: DSPIC33.33 54.37,25.94 v56.94,25.94 | FREE_PINS.8 69.81,16 62,16 v62,20
  Bottom 0.508: v56.94,25.94 62,20.88 v62,20
JMP9  (via drill 0.35)
  Top 0.508: v70.13,19.13 70.03,19.13 65.24,23.91 60,23.91 DSPIC33.34
  Bottom 0.508: FREE_PINS.9 75.65,10.16 75.65,11.73 70.13,17.25 v70.13,19.13
JMP10
  Top 0.508: DSPIC33.41 55.78,33.73 57.3,33.73 61.36,29.67 65.93,29.67 67.71,27.89 67.71,27.57 77.56,17.72 79.4,17.72 80.02,17.1 80.02,14.9 77.08,11.96 FREE_PINS.10
LED_0
  Top 0.508: DSPIC33.44 62,36.21 LC_LED0.A
LED_1  (via drill 0.35)
  Top 0.508: v57,30 56.81,29.81 DSPIC33.36
  Bottom 0.508: LC_LED1.A 62.43,30 v57,30
LED_2
  Top 0.508: DSPIC33.35 65.16,29.01 LC_LED2.A
LED_BACK  (via drill 0.35)
  Top 0.508: DSPIC33.38 v53.85,31.41
  Bottom 0.508: R8.2 44.13,84.86 44.13,59.58 43.73,59.18 43.73,46 43.73,45.45 43.73,41.31 46.27,38.77 46.49,38.77 v53.85,31.41
LED_FRONT  (via drill 0.35)
  Top 0.508: v53.85,30.61 DSPIC33.37
  Bottom 0.508: v53.85,30.61 48.97,25.73 48.7,25.73 44.6,21.63 44.6,20.7 45.6,19.7 R3.2
M0+
  Top 0.5: D4.C 70.74,54.79 70.1,55.43 70.1,55.37 M0_CONNECT1.2 67.56,52.83 58.79,52.83 58.59,52.63
  Top 0.508: D3.A 70.1,55.43 | H-BRIDGE_L293B.3 58.59,52.63
M0-
  Top 0.5: D1.A 65.74,58.93 64.01,58.93 62.42,57.34 D2.C | 61.36,55.59 D2.C | D2.C 65.74,54.53 M0_CONNECT1.1
  Top 0.508: H-BRIDGE_L293B.6 61.36,55.59
M1+  (via drill 0.35)
  Top 0.5: D8.C 36.52,55.57 35.05,54.1 | 35.05,54.1 v35.05,51.56 | M0_CONNECT2.2 34.22,54.1 35.05,54.1
  Top 0.508: H-BRIDGE_L293B.14 37.03,47.97 v37,48 | D7.A 34.04,57.51 v34.02,57.48
  Bottom 0.5: 33.27,56.74 33.03,56.5 M0_CONNECT2.2 | v35.05,51.56 35.08,51.54 35.08,49.92
  Bottom 0.508: 35.08,49.92 v37,48 | v34.02,57.48 33.27,56.74
M1-
  Top 0.5: D5.A 29.87,55.68 | 29.87,55.68 29.87,54.66 M0_CONNECT2.1 29.89,54.68 D6.C | 42,55.59 41.95,55.59 40.39,57.15 35.05,57.15 34.54,56.64 32.73,56.64 32.73,56.65 31.81,56.65 30.84,55.68 29.87,55.68
  Top 0.508: H-BRIDGE_L293B.11 42,55.59
MOTOR0_EN  (via drill 0.35)
  Top 0.508: DSPIC33.8 48.3,41.3 v49.79,42.79
  Bottom 0.508: v49.79,42.79 49.89,42.89 H-BRIDGE_L293B.1
MOTOR1_EN  (via drill 0.35)
  Top 0.508: DSPIC33.10 46.7,39.46 v46.74,39.5
  Bottom 0.508: H-BRIDGE_L293B.9 44.46,58.98 44.46,47 44.46,45.75 44.46,41.51 45.7,40.27 45.96,40.27 v46.74,39.5
N$1  (via drill 0.35)
  Top 0.508: v58,59 v60,57
N$2
  Bottom 0.508: LED1.K 46.7,6.03 R2.1
N$3
  Bottom 0.508: R1.2 24.24,22.14 D9.A
N$4  (via drill 0.35)
  other vias: 27,49
N$6
  Bottom 0.508: R5.2 73.04,34.19 LC_LED1.K
N$10
  Bottom 0.508: R6.2 73.03,27.47 LC_LED2.K
N$11
  Bottom 0.508: R4.2 73.12,40.95 LC_LED0.K
N$12
  Bottom 0.508: R2.2 44.73,8.44 TRANS_PMV65XPEA.3
N$13
  Bottom 0.508: TRANS_PMV65XPEA.1 43.72,12.9 R3.1
N$14
  Bottom 0.508: R7.1 LED2.K
N$15
  Bottom 0.508: TRANS_PMV65XPEA1.3 41,92.95 R7.2
N$16
  Bottom 0.508: R8.1 42.07,87.78 TRANS_PMV65XPEA1.1
OSC1
  Top 0.508: DSPIC33.30 51.5,25.08 54.08,22.5 OSCILLATOR.1
  Bottom 0.508: C10.1 58.67,21.73 OSCILLATOR.1
OSC2
  Top 0.508: DSPIC33.31 52.3,25.21 53.6,23.91 58.28,23.91 59.69,22.5 OSCILLATOR.2
  Bottom 0.508: C11.1 62.98,18.76 OSCILLATOR.2
PGEC1  (via drill 0.35)
  Top 0.508: v42.55,28.28 44.03,28.28 DSPIC33.22
  Bottom 0.508: PICKIT-3.5 37.36,28.28 v42.55,28.28
PGED1  (via drill 0.35)
  Top 0.508: v42.55,29.08 44.03,29.08 DSPIC33.21
  Bottom 0.508: PICKIT-3.4 35.62,29.08 v42.55,29.08
RESET  (via drill 0.35)
  Top 0.508: DSPIC33.18 39.16,31.41 v39.12,31.37 | RST_BUTTON.4 RST_BUTTON.3 22.51,27.33 v22.86,27.69
  Bottom 0.508: v39.12,31.37 30.29,31.37 PICKIT-3.1 26.95,30.48 R1.1 22.94,27.77 v22.86,27.69
SENSOR0
  Top 0.508: SENSOR0.1 48.12,18.88 46.7,20.3 DSPIC33.24
SENSOR1  (via drill 0.35)
  Top 0.508: v36.06,25.94 31.22,30.78 31.22,30.94 30.36,31.8 SENSOR1.1 | v42.98,26.02 45.51,26.02 DSPIC33.23
  Bottom 0.508: v36.06,25.94 36.13,26.02 v42.98,26.02
SENSOR2
  Top 0.508: DSPIC33.25 47.5,23.5 50.06,20.94 67.28,20.94 72.23,16 SENSOR2.1
UART_RX
  Top 0.508: DSPIC33.43 60.57,35.41 63.15,32.83 80.02,32.83 UART.2
UART_TX
  Top 0.508: DSPIC33.42 60.44,34.61 63.38,31.67 80.6,31.67 UART.3
UT_BUTTON  (via drill 0.35)
  Top 0.508: v23.5,13.59 21.12,13.59 UT_BUTTON.3 UT_BUTTON.4 | DSPIC33.14 43.96,34.47 40.25,34.47 37.73,31.94 v37.73,23.97
  Bottom 0.508: v23.5,13.59 R9.1 31.58,13.58 31.58,17.83 v37.73,23.97
VCAP/VDDCORE  (via drill 0.35)
  Top 0.508: DSPIC33.7 49.1,39.19 v49.15,39.24
  Bottom 0.508: v49.15,39.24 49.15,40.65 C16.+

### Text on the board
tPlace: MicroMouse 2020